# Altium schematic sheet CON_RS485_PWR_RJ45X2.SchDoc: CAN Connector DB9 Male
size A4; Organization: Altium Limited.; Address1: Level 3, 12a Rodborough Rd; Address2: Frenchs Forest 2086; Address3: NSW; Address4: AUSTRALIA; SheetNumber: 1; SheetTotal: 100
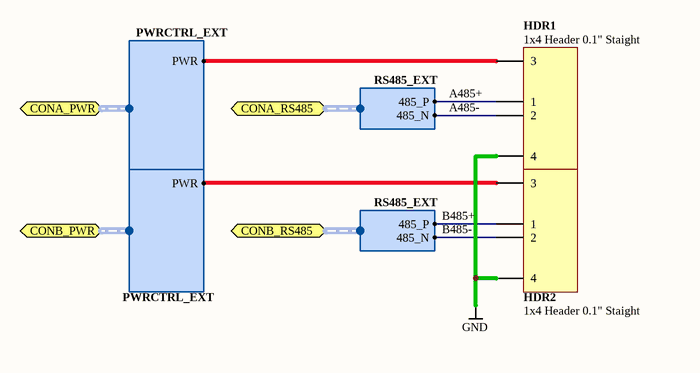
[diagram p0: CON_RS485_PWR_RJ45X2.SchDoc]

## Parts
HDR1  1x4 Header 0.1" Staight  [HDR1X4]
HDR2  1x4 Header 0.1" Staight  [HDR1X4]

## Ports
CONA_PWR (harness PWRCTRL_EXT), CONA_RS485 (harness RS485_EXT), CONB_PWR (harness PWRCTRL_EXT), CONB_RS485 (harness RS485_EXT)

## Harnesses
RS485_EXT: 485_P, 485_N
PWRCTRL_EXT: PWR

## Nets
GND: HDR1.4 HDR2.4
A485+: HDR1.1 ; port CONA_RS485.485_P
A485-: HDR1.2 ; port CONA_RS485.485_N
B485+: HDR2.1 ; port CONB_RS485.485_P
B485-: HDR2.2 ; port CONB_RS485.485_N
NetHDR1_3: HDR1.3 ; port CONA_PWR.PWR
NetHDR2_3: HDR2.3 ; port CONB_PWR.PWR

## Notes on the sheet
- Sheet Title
- Project Title
- Size:
- Date:
- A4
- Assy:
- Time:
- Revision:
- Sheet
- of
- File:

## Library data of the parts
HDR1 HDR2 = D-300-0064: Header, 1x4, 0.1", Straight, 15mm High; Max Current: mA; Connector type: Header; Mounting Technology: Through-Hole; Status: Production; Category: Connector